# EasyEDA schematic SCH_BQ25798-test-board-mppt-solar_2026-01-12.json
TITLE: BQ25798 test board mppt; REV: 2.1; Date: 2025-12-12; Sheet: 1/1; Drawn By: Marek128b; Company: Your Company
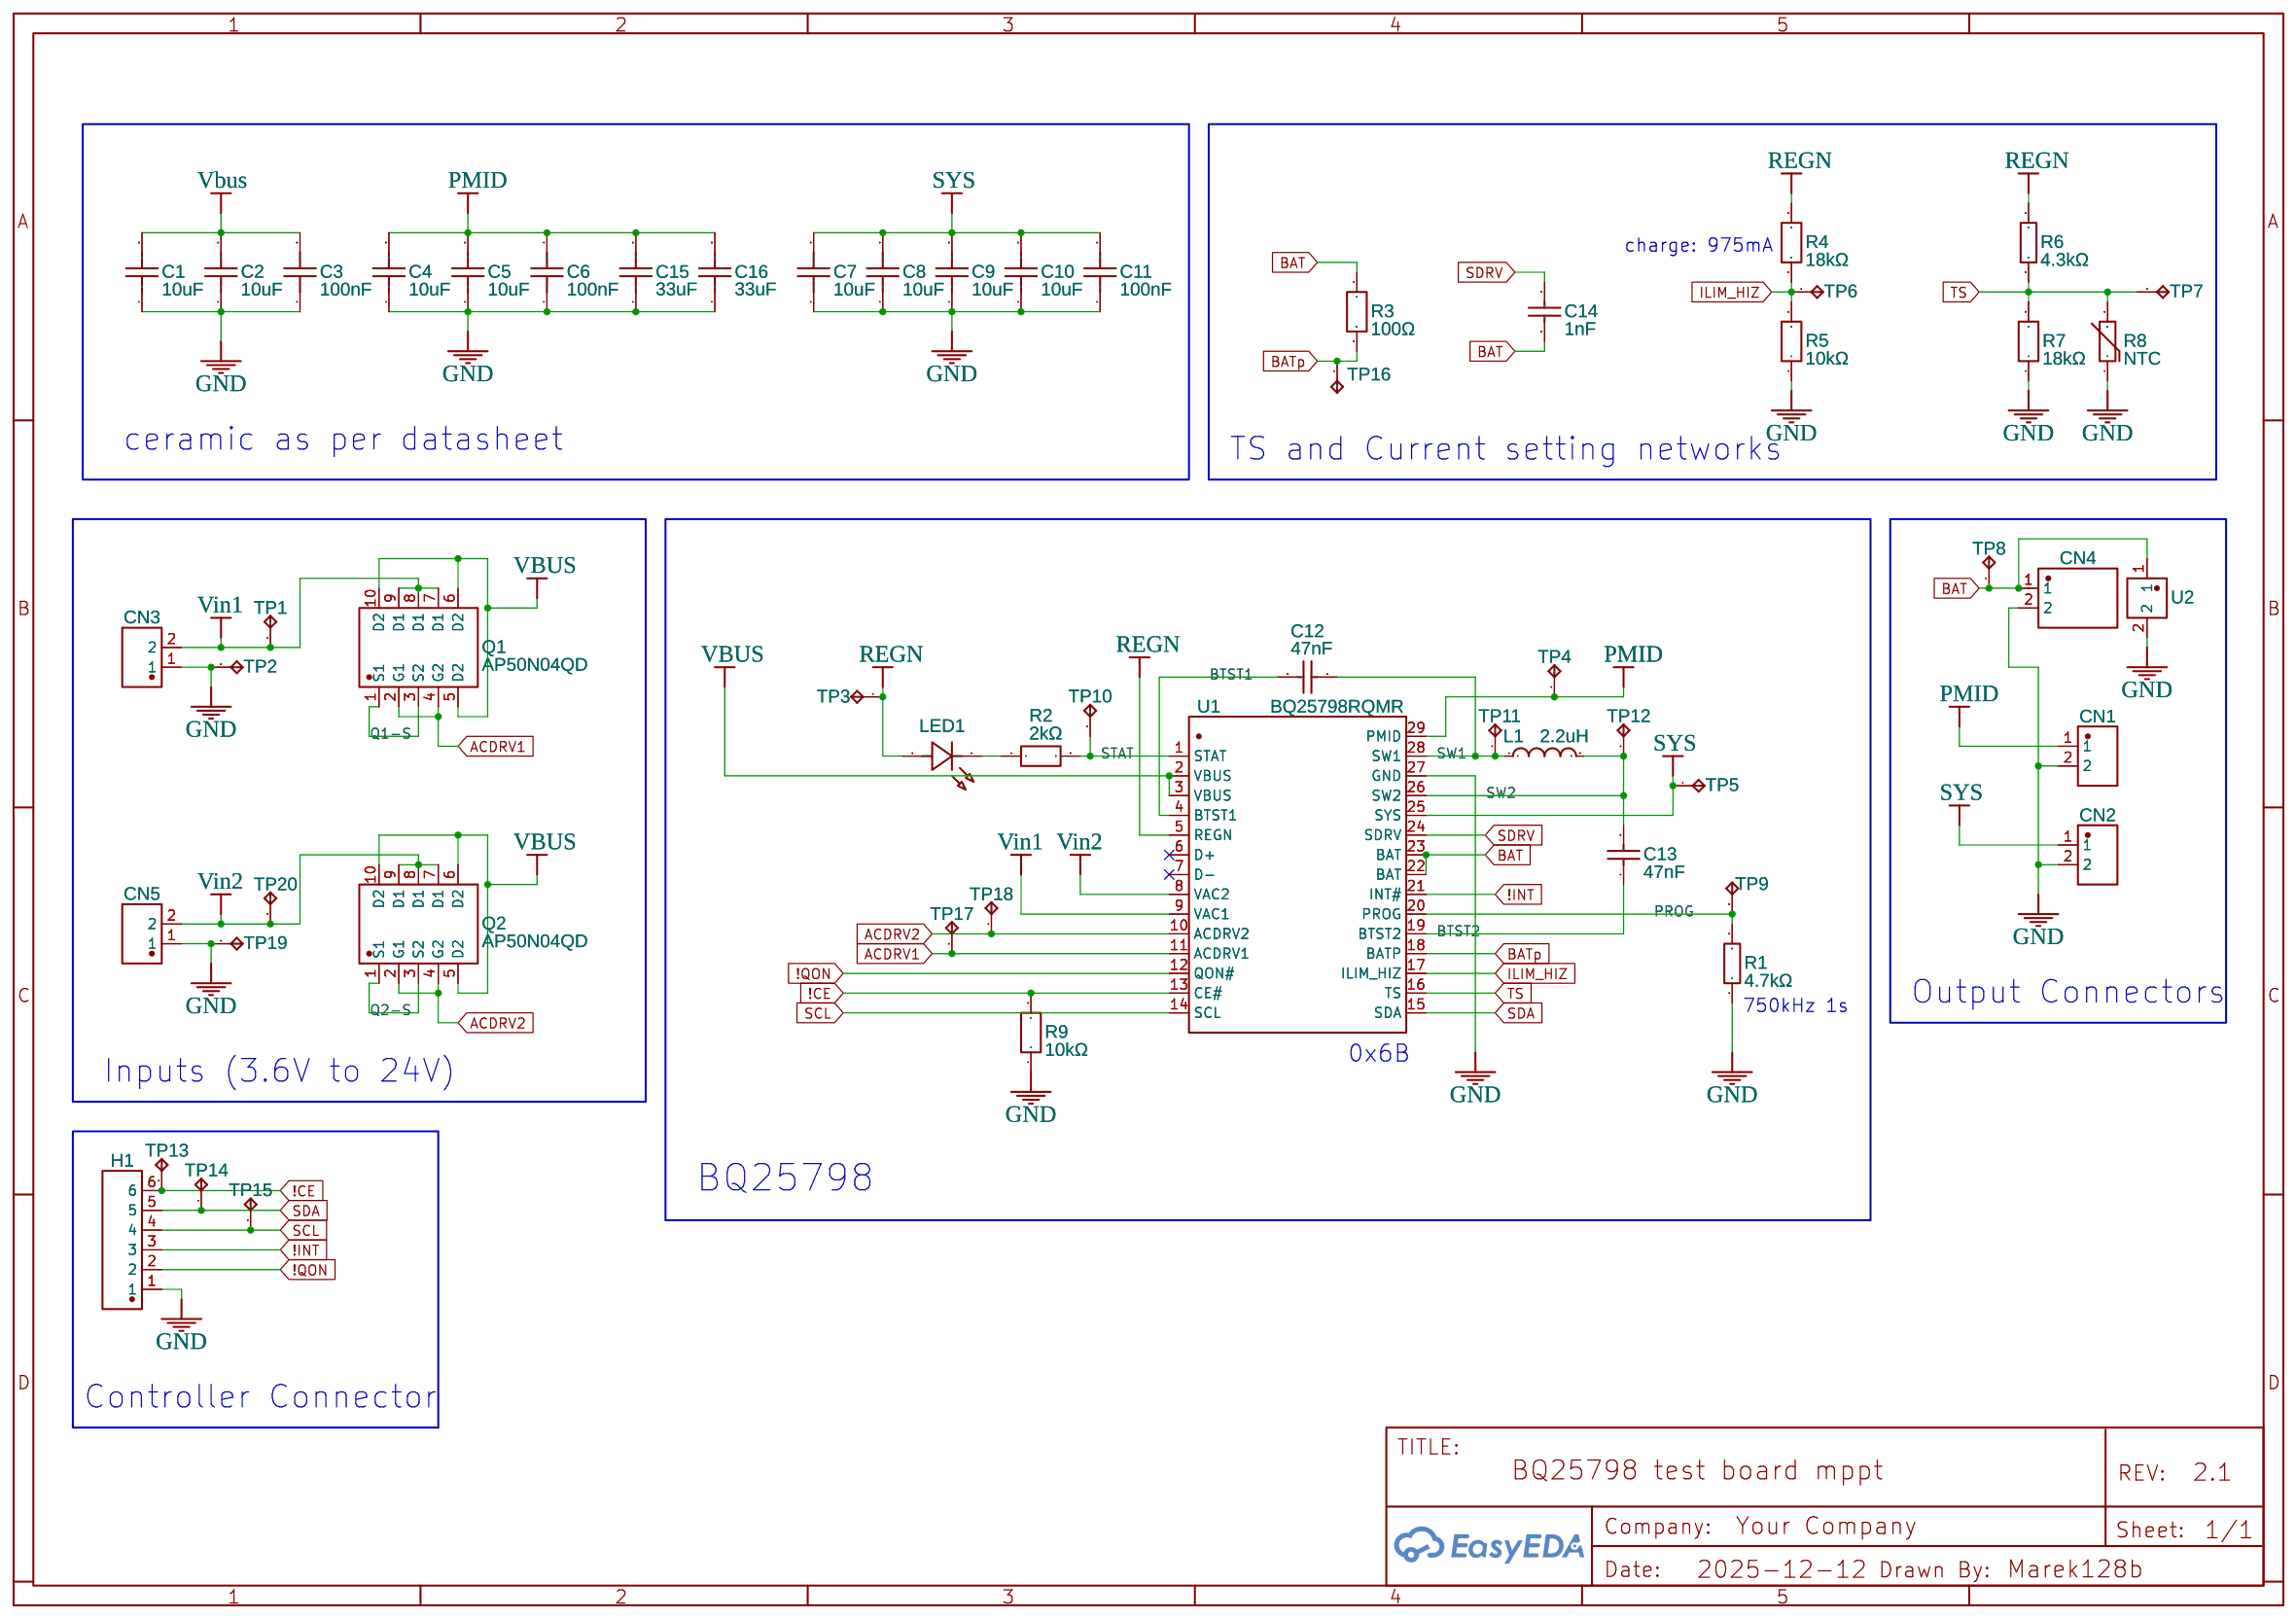
[diagram p0: schematic sheet]

## Parts
C1  10uF  [C0805]
C2  10uF  [C0805]
C3  100nF  [C0603]
C4  10uF  [C0805]
C5  10uF  [C0805]
C6  100nF  [C0603]
C7  10uF  [C0805]
C8  10uF  [C0805]
C9  10uF  [C0805]
C10  10uF  [C0805]
C11  100nF  [C0603]
C12  47nF  [C0603]
C13  47nF  [C0603]
C14  1nF  [C0603]
C15  33uF  [C1206]
C16  33uF  [C1206]
CN1  MX126-5.0-GN01-02P-CU-S-A  [CONN-TH_2P-P5.00_MX126-5.0-GN01-02P-CU-S-A]
CN2  MX126-5.0-GN01-02P-CU-S-A  [CONN-TH_2P-P5.00_MX126-5.0-GN01-02P-CU-S-A]
CN3  MX126-5.0-GN01-02P-CU-S-A  [CONN-TH_2P-P5.00_MX126-5.0-GN01-02P-CU-S-A]
CN4  B2B-XH-A (LF)(SN)  [CONN-TH_B2B-XH-A-LF-SN]
CN5  MX126-5.0-GN01-02P-CU-S-A  [CONN-TH_2P-P5.00_MX126-5.0-GN01-02P-CU-S-A]
H1  HB-PH3-25416PB2GOP  [HDR-TH_6P-P2.54-V-M]
L1  2.2uH  [IND-SMD_L7.0-W6.6_MCW-0650-220]
LED1  XL-2012UBC  [LED0805-RD]
Q1  AP50N04QD  [PDFN-8_L3.2-W3.1-P0.65-LS3.4-BL-EP2]
Q2  AP50N04QD  [PDFN-8_L3.2-W3.1-P0.65-LS3.4-BL-EP2]
R1  4.7kΩ  [R0805]
R2  2kΩ  [R0805]
R3  100Ω  [R0805]
R4  18kΩ  [R0805]
R5  10kΩ  [R0805]
R6  4.3kΩ  [R0805]
R7  18kΩ  [R0805]
R8  NTC  [R0805]
R9  10kΩ  [R0805]
TP1  TP  [TP]
TP2  TP  [TP]
TP3  TP  [TP]
TP4  TP  [TP]
TP5  TP  [TP]
TP6  TP  [TP]
TP7  TP  [TP]
TP8  TP  [TP]
TP9  TP  [TP]
TP10  TP  [TP]
TP11  TP  [TP]
TP12  TP  [TP]
TP13  TP  [TP]
TP14  TP  [TP]
TP15  TP  [TP]
TP16  TP  [TP]
TP17  TP  [TP]
TP18  TP  [TP]
TP19  TP  [TP]
TP20  TP  [TP]
U1  BQ25798RQMR  [QFN-29_L4.0-W4.0-P0.40-TL-BQ25792RQMR]
U2  XT60PB-M.G.Y  [CONN-TH_XT60PB-M]

## Library data of the parts
C1 C2 C4 C5 C7-C10 = CL21A106KAYNNNE: Supplier: LCSC; Manufacturer: SAMSUNG(三星); Supplier Part: C15850; JLCPCB Part Class: Basic Part
C3 C6 C11 = CC0603KRX7R9BB104: Supplier: LCSC; Manufacturer: YAGEO(国巨); Supplier Part: C14663; JLCPCB Part Class: Basic Part
C12 C13 = CC0603KRX7R9BB473: Supplier: LCSC; Manufacturer: YAGEO(国巨); Supplier Part: C107093; JLCPCB Part Class: Extended Part
C14 = CC0603KRX7R9BB102: Supplier: LCSC; Manufacturer: YAGEO(国巨); Supplier Part: C100040; JLCPCB Part Class: Extended Part
C15 C16 = C3216X5R1E336MT000E: Contributor: LCSC; Supplier: LCSC; Supplier Part: C342307; Manufacturer: TDK; JLCPCB Part Class: Extended Part
CN1-CN3 CN5 = MX126-5.0-GN01-02P-CU-S-A: Supplier: LCSC; Supplier Part: C5188434; Manufacturer: MAX(迈旭); Manufacturer Part: MX126-5.0-02P-GN01-Cu-S-A; JLCPCB Part Class: Extended Part; Contributor: lcsc
CN4 = B2B-XH-A (LF)(SN): Contributor: LCSC; Supplier: LCSC; Supplier Part: C158012; Manufacturer: JST; Manufacturer Part: B2B-XH-A(LF)(SN); JLCPCB Part Class: Extended Part
H1 = HB-PH3-25416PB2GOP: Supplier: LCSC; Supplier Part: C6332199; Manufacturer: HANBO(汉博); JLCPCB Part Class: Extended Part; Contributor: lcsc
L1 = APH0630T2R2M: Supplier: LCSC; Supplier Part: C5349701; Manufacturer: APV(爱普微); Contributor: lcsc; JLCPCB Part Class: Extended Part
LED1 = XL-2012UBC: Contributor: LCSC; Supplier: LCSC; Supplier Part: C965817; Manufacturer: XINGLIGHT(成兴光); JLCPCB Part Class: Extended Part
Q1 Q2 = AP50N04QD: Contributor: lcsc; Supplier: LCSC; Supplier Part: C5443706; Manufacturer: ALLPOWER(铨力); JLCPCB Part Class: Extended Part
R1 = RC0805FR-074K7L: Supplier: LCSC; Manufacturer: YAGEO(国巨); Supplier Part: C60816; JLCPCB Part Class: Extended Part
R2 = FRC0805F2001TS: Contributor: lcsc; Supplier: LCSC; Supplier Part: C2907248; Manufacturer: FOJAN(富捷); JLCPCB Part Class: Extended Part
R3 = FRC0805J101 TS: Supplier: LCSC; Supplier Part: C2907294; Manufacturer: FOJAN(富捷); JLCPCB Part Class: Extended Part; Contributor: lcsc
R4 R7 = FRC0805F1802TS: Contributor: lcsc; Supplier: LCSC; Supplier Part: C2907231; Manufacturer: FOJAN(富捷); JLCPCB Part Class: Extended Part
R5 R9 = FRC0805J103TS: Contributor: lcsc; Supplier: LCSC; Supplier Part: C2930231; Manufacturer: FOJAN(富捷); JLCPCB Part Class: Extended Part
R6 = 0805W8F4301T5E: Supplier: LCSC; Manufacturer: UNI-ROYAL(厚声); Supplier Part: C17667; JLCPCB Part Class: Extended Part
R8 = CMFB103F3950FANT: Supplier: LCSC; Manufacturer: FH(风华); Supplier Part: C51597; JLCPCB Part Class: Extended Part
TP1-TP20 = TP: Contributor: Clash Crafter 6
U1 = BQ25798RQMR: Contributor: lcsc; Supplier: LCSC; Supplier Part: C2876593; Manufacturer: TI(德州仪器); JLCPCB Part Class: Extended Part
U2 = XT60PB-M.G.Y: Supplier: LCSC; Supplier Part: C19268037; Manufacturer: AMASS(艾迈斯); JLCPCB Part Class: Extended Part; Contributor: lcsc

## Nets
GND: C1.1 C2.1 C3.1 C4.1 C5.1 C6.1 C7.1 C8.1 C9.1 C10.1 C11.1 C15.1 C16.1 CN1.2 CN2.2 CN3.1 CN4.2 CN5.1 H1.1 R1.1 R5.1 R7.1 R8.1 R9.1 TP2.1 TP19.1 U1.27(GND) U2.2
VBUS: Q1.5(D2) Q1.6(D2) Q1.10(D2) Q2.5(D2) Q2.6(D2) Q2.10(D2) U1.2(VBUS) U1.3(VBUS)
Vbus: C1.2 C2.2 C3.2
Vin1: CN3.2 Q1.7(D1) Q1.8(D1) Q1.9(D1) TP1.1 U1.9(VAC1)
Vin2: CN5.2 Q2.7(D1) Q2.8(D1) Q2.9(D1) TP20.1 U1.8(VAC2)
!CE: H1.6 R9.2 TP13.1 U1.13(CE#)
!INT: H1.3 U1.21(INT#)
!QON: H1.2 U1.12(QON#)
ACDRV1: Q1.2(G1) Q1.4(G2) TP17.1 U1.11(ACDRV1)
ACDRV2: Q2.2(G1) Q2.4(G2) TP18.1 U1.10(ACDRV2)
BAT: C14.1 CN4.1 R3.1 TP8.1 U1.22(BAT) U1.23(BAT) U2.1
BATp: R3.2 TP16.1 U1.18(BATP)
BTST1: C12.2 U1.4(BTST1)
BTST2: C13.1 U1.19(BTST2)
ILIM_HIZ: R4.1 R5.2 TP6.1 U1.17(ILIM_HIZ)
PMID: C4.2 C5.2 C6.2 C15.2 C16.2 CN1.1 TP4.1 U1.29(PMID)
PROG: R1.2 TP9.1 U1.20(PROG)
Q1-S: Q1.1(S1) Q1.3(S2)
Q2-S: Q2.1(S1) Q2.3(S2)
REGN: LED1.2(A) R4.2 R6.2 TP3.1 U1.5(REGN)
SCL: H1.4 TP15.1 U1.14(SCL)
SDA: H1.5 TP14.1 U1.15(SDA)
SDRV: C14.2 U1.24(SDRV)
STAT: R2.2 TP10.1 U1.1(STAT)
SW1: C12.1 L1.1 TP11.1 U1.28(SW1)
SW2: C13.2 L1.2 TP12.1 U1.26(SW2)
SYS: C7.2 C8.2 C9.2 C10.2 C11.2 CN2.1 TP5.1 U1.25(SYS)
TS: R6.1 R7.2 R8.2 TP7.1 U1.16(TS)
Net-(LED1-1): LED1.1(K) R2.1

Not connected (* = marked no-connect by the designer): U1 6(D+)* 7(D-)*

## Notes on the sheet
- charge: 975mA
- ceramic as per datasheet
- TS and Current setting networks
- Output Connectors
- 750kHz 1s
- 0x6B
- Inputs (3.6V to 24V)
- BQ25798
- Controller Connector
